# Altium schematic sheet CanTransceiver.SchDoc
size A
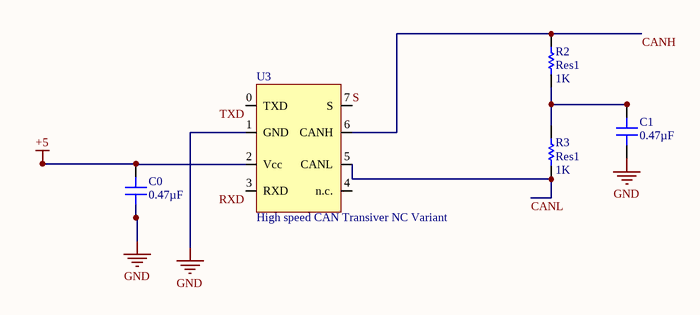
[diagram p0: CanTransceiver.SchDoc]

## Parts
C0  0.47µF  [CAP 0805_2012]
C1  0.47µF  [CAP 0805_2012]
R2  Res1  value 1K  [AXIAL-0.3]
R3  Res1  value 1K  [AXIAL-0.3]
U3  High speed CAN Transiver NC Variant  [TJA1051T]

## Nets
+5: C0.2 U3.2(Vcc)
GND: C0.1 C1.1 U3.1(GND)
CANH: R2.2 U3.6(CANH)
CANL: R3.1 U3.5(CANL)
RXD: U3.3(RXD)
S: U3.7(S)
TXD: U3.0(TXD)
NetC1_2: C1.2 R2.1 R3.2

Not connected (* = marked no-connect by the designer): U3 4(n.c.)

## Library data of the parts
C0 C1 = C0805X474K4RACAUTO: CAP CER 0.47UF 16V X7R 0805 AUTO; Manufacturer: KEMET; Tolerance: ±10%; Part Number: C0805X474K4RACAUTO; Value: 0.47µF; Applications: Automotive, Boardflex Sensitive; Capacitance: 0.47µF; ComponentLink1Description: Datasheet; ComponentLink1URL: https://api.kemet.com/component-edge/download/datasheet/C0805X474K4RACAUTO.pdf; ComponentLink2Description: DigiKey Link; ComponentLink2URL: http://digikey.com/product-detail/en/kemet/C0805X474K4RACAUTO/399-16453-1-ND/7803645; Device Package: 0805 (2012 Metric); Features: Soft Termination; LastUpdated: 1/21/2020 12:03:05 AM; Lifecycle Status: Active; Minimum Order: 1; Mounting Type: Surface Mount, MLCC; Operating Temperature: -55°C ~ 125°C; Package / Case: 0805 (2012 Metric); Packaging: TapeAndReel; PartId: 2963; Part Status: Active; Price: 0.25; Ratings: AEC-Q200; Series: SMD Auto X7R Flex; Size / Dimension: 0.079" L x 0.049" W (2.00mm x 1.25mm); Supplier 1: DigiKey; Supplier Part Number 1: 399-16453-1-ND; Temperature Coefficient: X7R; Thickness (Max): 0.039" (1.00mm); Voltage - Rated: 16V
R2 R3 = Res1: Resistor; Published: 8-Jun-2000; LatestRevisionDate: 17-Jul-2002; LatestRevisionNote: Re-released for DXP Platform.; PackageReference: AXIAL-0.3; Publisher: Altium Limited; PackageDescription: Axial Device, Thru-Hole; 2 Leads; 0.3 in Pin Spacing
U3 = TJA1051T